# Altium schematic sheet MCU.SchDoc
size 558 x 431 mm; SheetNumber: 2; SheetTotal: 3
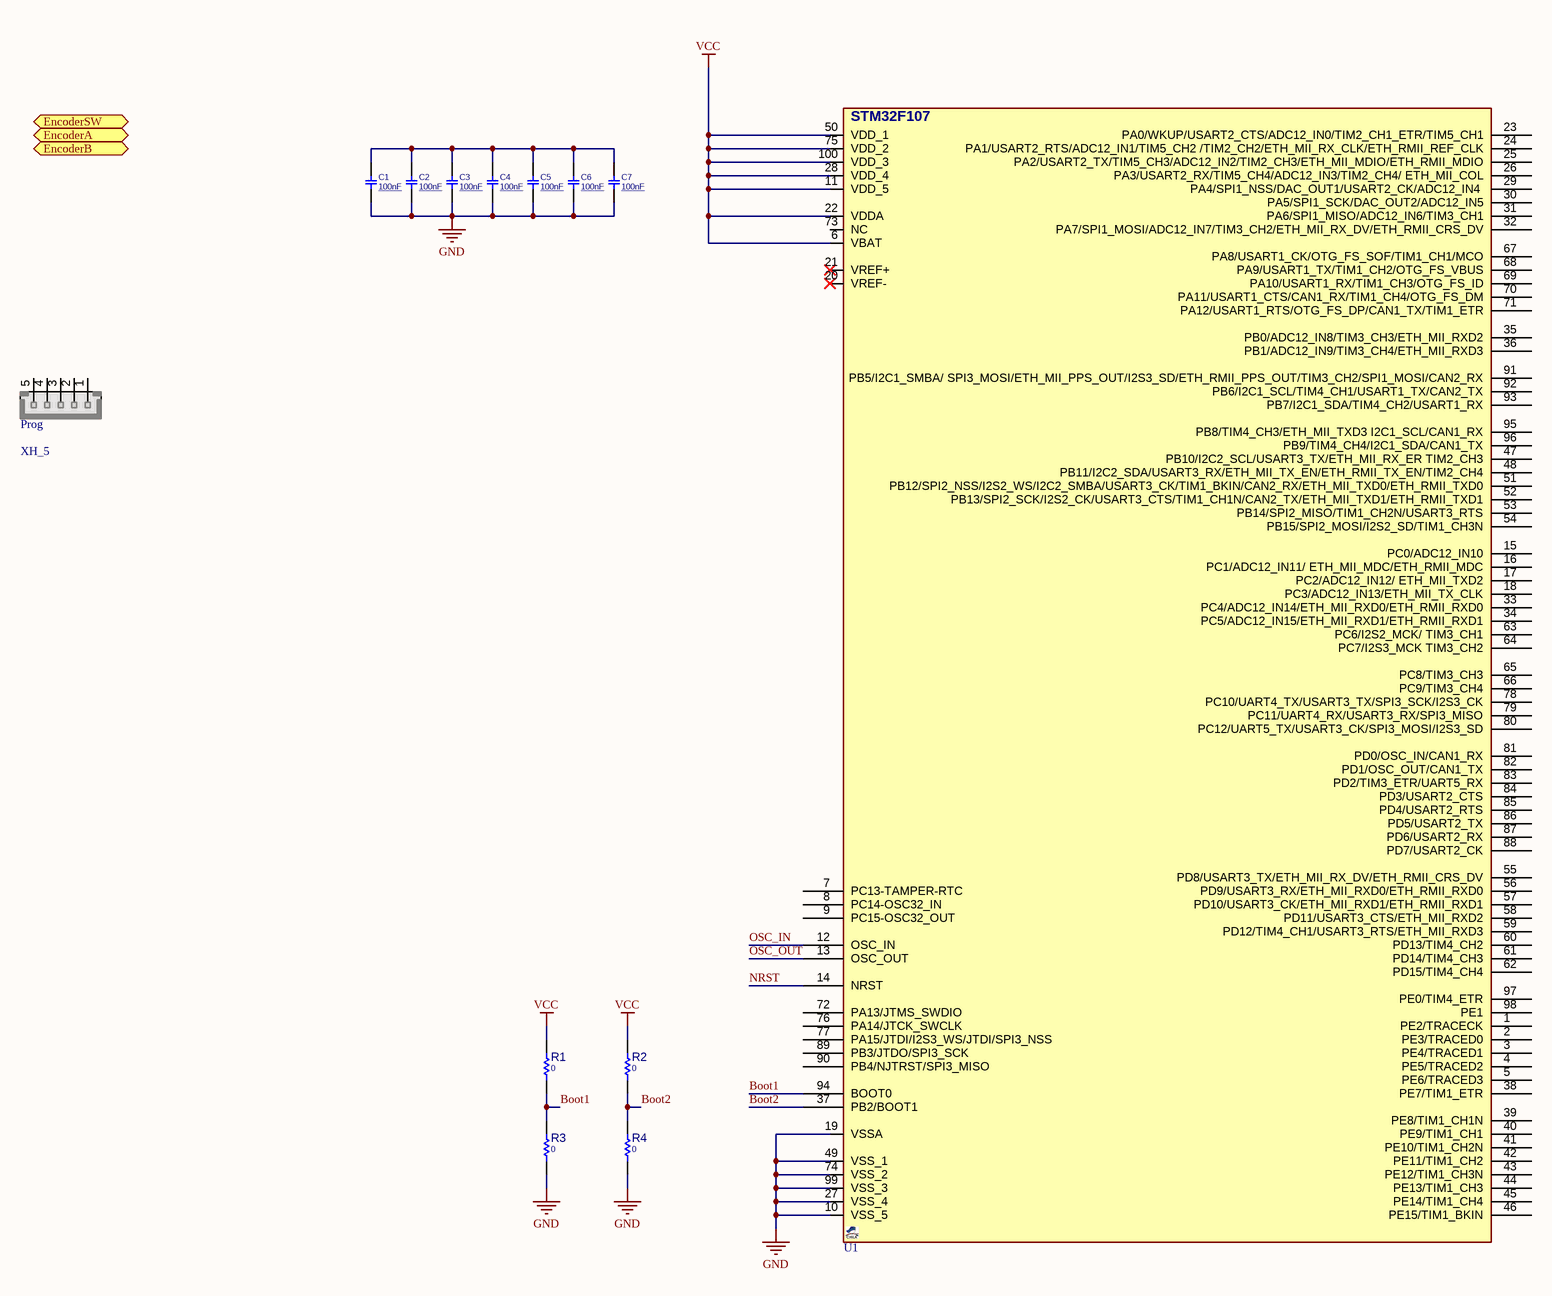
[diagram p0: MCU.SchDoc]

## Parts
C1  100nF  [C0805]
C2  100nF  [C0805]
C3  100nF  [C0805]
C4  100nF  [C0805]
C5  100nF  [C0805]
C6  100nF  [C0805]
C7  100nF  [C0805]
Prog  XH_5  [XH_5]
R1  0  [R0805]
R2  0  [R0805]
R3  0  [R0805]
R4  0  [R0805]
U1  STM32F107  [QFG50_100]  (value not drawn)

## Ports
EncoderA (bidir), EncoderB (bidir), EncoderSW (bidir)

## Nets
GND: C1.2 C2.2 C3.2 C4.2 C5.2 C6.2 C7.2 R3.1 R4.1 U1.10(VSS_5) U1.19(VSSA) U1.27(VSS_4) U1.49(VSS_1) U1.74(VSS_2) U1.99(VSS_3)
VCC: R1.2 R2.2 U1.6(VBAT) U1.11(VDD_5) U1.22(VDDA) U1.28(VDD_4) U1.50(VDD_1) U1.75(VDD_2) U1.100(VDD_3)
Boot1: R1.1 R3.2 U1.94(BOOT0)
Boot2: R2.1 R4.2 U1.37(PB2/BOOT1)
NRST: U1.14(NRST)
OSC_IN: U1.12(OSC_IN)
OSC_OUT: U1.13(OSC_OUT)
NetC1_1: C1.1 C2.1 C3.1 C4.1 C5.1 C6.1 C7.1

Not connected (* = marked no-connect by the designer): Prog 1 2 3 4 5; U1 1(PE2/TRACECK) 2(PE3/TRACED0) 3(PE4/TRACED1) 4(PE5/TRACED2) 5(PE6/TRACED3) 7(PC13-TAMPER-RTC) 8(PC14-OSC32_IN) 9(PC15-OSC32_OUT) 15(PC0/ADC12_IN10) 16(PC1/ADC12_IN11/_ETH_MII_MDC/ETH_RMII_MDC) 17(PC2/ADC12_IN12/_ETH_MII_TXD2) 18(PC3/ADC12_IN13/ETH_MII_TX_CLK) 20(VREF-)* 21(VREF+)* 23(PA0/WKUP/USART2_CTS/ADC12_IN0/TIM2_CH1_ETR/TIM5_CH1) 24(PA1/USART2_RTS/ADC12_IN1/TIM5_CH2_/TIM2_CH2/ETH_MII_RX_CLK/ETH_RMII_REF_CLK) 25(PA2/USART2_TX/TIM5_CH3/ADC12_IN2/TIM2_CH3/ETH_MII_MDIO/ETH_RMII_MDIO) 26(PA3/USART2_RX/TIM5_CH4/ADC12_IN3/TIM2_CH4/_ETH_MII_COL) 29(PA4/SPI1_NSS/DAC_OUT1/USART2_CK/ADC12_IN4_) 30(PA5/SPI1_SCK/DAC_OUT2/ADC12_IN5) 31(PA6/SPI1_MISO/ADC12_IN6/TIM3_CH1) 32(PA7/SPI1_MOSI/ADC12_IN7/TIM3_CH2/ETH_MII_RX_DV/ETH_RMII_CRS_DV) 33(PC4/ADC12_IN14/ETH_MII_RXD0/ETH_RMII_RXD0) 34(PC5/ADC12_IN15/ETH_MII_RXD1/ETH_RMII_RXD1) 35(PB0/ADC12_IN8/TIM3_CH3/ETH_MII_RXD2) 36(PB1/ADC12_IN9/TIM3_CH4/ETH_MII_RXD3) 38(PE7/TIM1_ETR) 39(PE8/TIM1_CH1N) 40(PE9/TIM1_CH1) 41(PE10/TIM1_CH2N) 42(PE11/TIM1_CH2) 43(PE12/TIM1_CH3N) 44(PE13/TIM1_CH3) 45(PE14/TIM1_CH4) 46(PE15/TIM1_BKIN) 47(PB10/I2C2_SCL/USART3_TX/ETH_MII_RX_ER_TIM2_CH3) 48(PB11/I2C2_SDA/USART3_RX/ETH_MII_TX_EN/ETH_RMII_TX_EN/TIM2_CH4) 51(PB12/SPI2_NSS/I2S2_WS/I2C2_SMBA/USART3_CK/TIM1_BKIN/CAN2_RX/ETH_MII_TXD0/ETH_RMII_TXD0) 52(PB13/SPI2_SCK/I2S2_CK/USART3_CTS/TIM1_CH1N/CAN2_TX/ETH_MII_TXD1/ETH_RMII_TXD1) 53(PB14/SPI2_MISO/TIM1_CH2N/USART3_RTS) 54(PB15/SPI2_MOSI/I2S2_SD/TIM1_CH3N) 55(PD8/USART3_TX/ETH_MII_RX_DV/ETH_RMII_CRS_DV) 56(PD9/USART3_RX/ETH_MII_RXD0/ETH_RMII_RXD0) 57(PD10/USART3_CK/ETH_MII_RXD1/ETH_RMII_RXD1) 58(PD11/USART3_CTS/ETH_MII_RXD2) 59(PD12/TIM4_CH1/USART3_RTS/ETH_MII_RXD3) 60(PD13/TIM4_CH2) 61(PD14/TIM4_CH3) 62(PD15/TIM4_CH4) 63(PC6/I2S2_MCK/_TIM3_CH1) 64(PC7/I2S3_MCK_TIM3_CH2) 65(PC8/TIM3_CH3) 66(PC9/TIM3_CH4) 67(PA8/USART1_CK/OTG_FS_SOF/TIM1_CH1/MCO) 68(PA9/USART1_TX/TIM1_CH2/OTG_FS_VBUS) 69(PA10/USART1_RX/TIM1_CH3/OTG_FS_ID) 70(PA11/USART1_CTS/CAN1_RX/TIM1_CH4/OTG_FS_DM) 71(PA12/USART1_RTS/OTG_FS_DP/CAN1_TX/TIM1_ETR) 72(PA13/JTMS_SWDIO) 73(NC) 76(PA14/JTCK_SWCLK) 77(PA15/JTDI/I2S3_WS/JTDI/SPI3_NSS) 78(PC10/UART4_TX/USART3_TX/SPI3_SCK/I2S3_CK) 79(PC11/UART4_RX/USART3_RX/SPI3_MISO) 80(PC12/UART5_TX/USART3_CK/SPI3_MOSI/I2S3_SD) 81(PD0/OSC_IN/CAN1_RX) 82(PD1/OSC_OUT/CAN1_TX) 83(PD2/TIM3_ETR/UART5_RX) 84(PD3/USART2_CTS) 85(PD4/USART2_RTS) 86(PD5/USART2_TX) 87(PD6/USART2_RX) 88(PD7/USART2_CK) 89(PB3/JTDO/SPI3_SCK) 90(PB4/NJTRST/SPI3_MISO) 91(PB5/I2C1_SMBA/_SPI3_MOSI/ETH_MII_PPS_OUT/I2S3_SD/ETH_RMII_PPS_OUT/TIM3_CH2/SPI1_MOSI/CAN2_RX) 92(PB6/I2C1_SCL/TIM4_CH1/USART1_TX/CAN2_TX) 93(PB7/I2C1_SDA/TIM4_CH2/USART1_RX) 95(PB8/TIM4_CH3/ETH_MII_TXD3_I2C1_SCL/CAN1_RX) 96(PB9/TIM4_CH4/I2C1_SDA/CAN1_TX) 97(PE0/TIM4_ETR) 98(PE1)

## Notes on the sheet
- DWG. NO.
- REV.
- SHT.
- REVISION
- DESCRIPTION
- DATE
- APPROVED
- THIS DOCUMENT AND THE DATA DISCLOSED HEREIN OR HEREWITH IS THE PROPERTY OF ALTIUM LIMITED AND MAY BE FREELY DISTRIBUTED IN WHOLE. NO RIGHTS ARE RESERVED OR EXPRESS OR IMPLIED WARANTEE GIVEN.
- ENG:
- DSN:
- APPROVALS
- PROJECT
- DOCUMENT REVISION:
- DESIGN ITEM:
- CHK:
- BOM:
- REFERENCE DOCUMENTS
- PROJECT REVISION:
- TITLE
- FAB DWG:
- PCB DWG:
- ASSY DWG:
- SCALE:
- SIZE
- C
- CAGE CODE
- FILE NAME
- DWG NO.
- SHEET
- OF
- REV

## Library data of the parts
C1-C7 = CAP_SMD_MLCC_0805: CAP, MLCC, 100nF, 50V,0805; PARAM: -, -%; MANF_P#: MANF_PART#; PRICE: 100= 1$; MANF: -; PARAM2: 50V; ASSEMBLY: ASSEMBLY; VALUE: 100nF
Prog = XH_5: JST-XH pitch: 2.5mm; MANF_P#: JST-B5B-XHA; MANF: JST; VALUE: XH_5
R1-R4 = RES_SMD_0805: RESISTOR, SMD; PARAM: 0.125W; DESC: DESCRIPTION; DIST#: MOUSER; PARAM2: 10%; MANF_P#: -; MANF: -; ASSEMBLY: ASSEMBLY; PRICE: 100= 0.5$; VALUE: 0
U1 = STM32F107VBT6_QFP100: MCU, STM32 ARM 32-bit, Cortex M3, 256KB FLASH, 64KB SRAM; DESC: USB OTG, ETHERNET, 2ADC, DAC, CAN, I2C, SPI, UART; MANF: ST; PARAM2: 2~3.6VCC, 72MHz, 2X12Bit ADC, 2X12Bit DAC; PARAM: 256KB FLASH, 64KB SRAM, -40~85oC; MANF_P#: STM32F107VBT6; PRICE: 9$; VALUE: STM32F107